# Altium schematic sheet 07.MIPI_DSI.SchDoc
size A4; CheckedBy: YPC; DocumentNumber: 7; Revision: V1.00; SheetNumber: 07; SheetTotal: 18; SheetName: MIPI_DSI; SheetDescribe: SheetDescribe; Designer: JOW; DesignDate: 2025-04-25; CheckedData: 2025-04-25
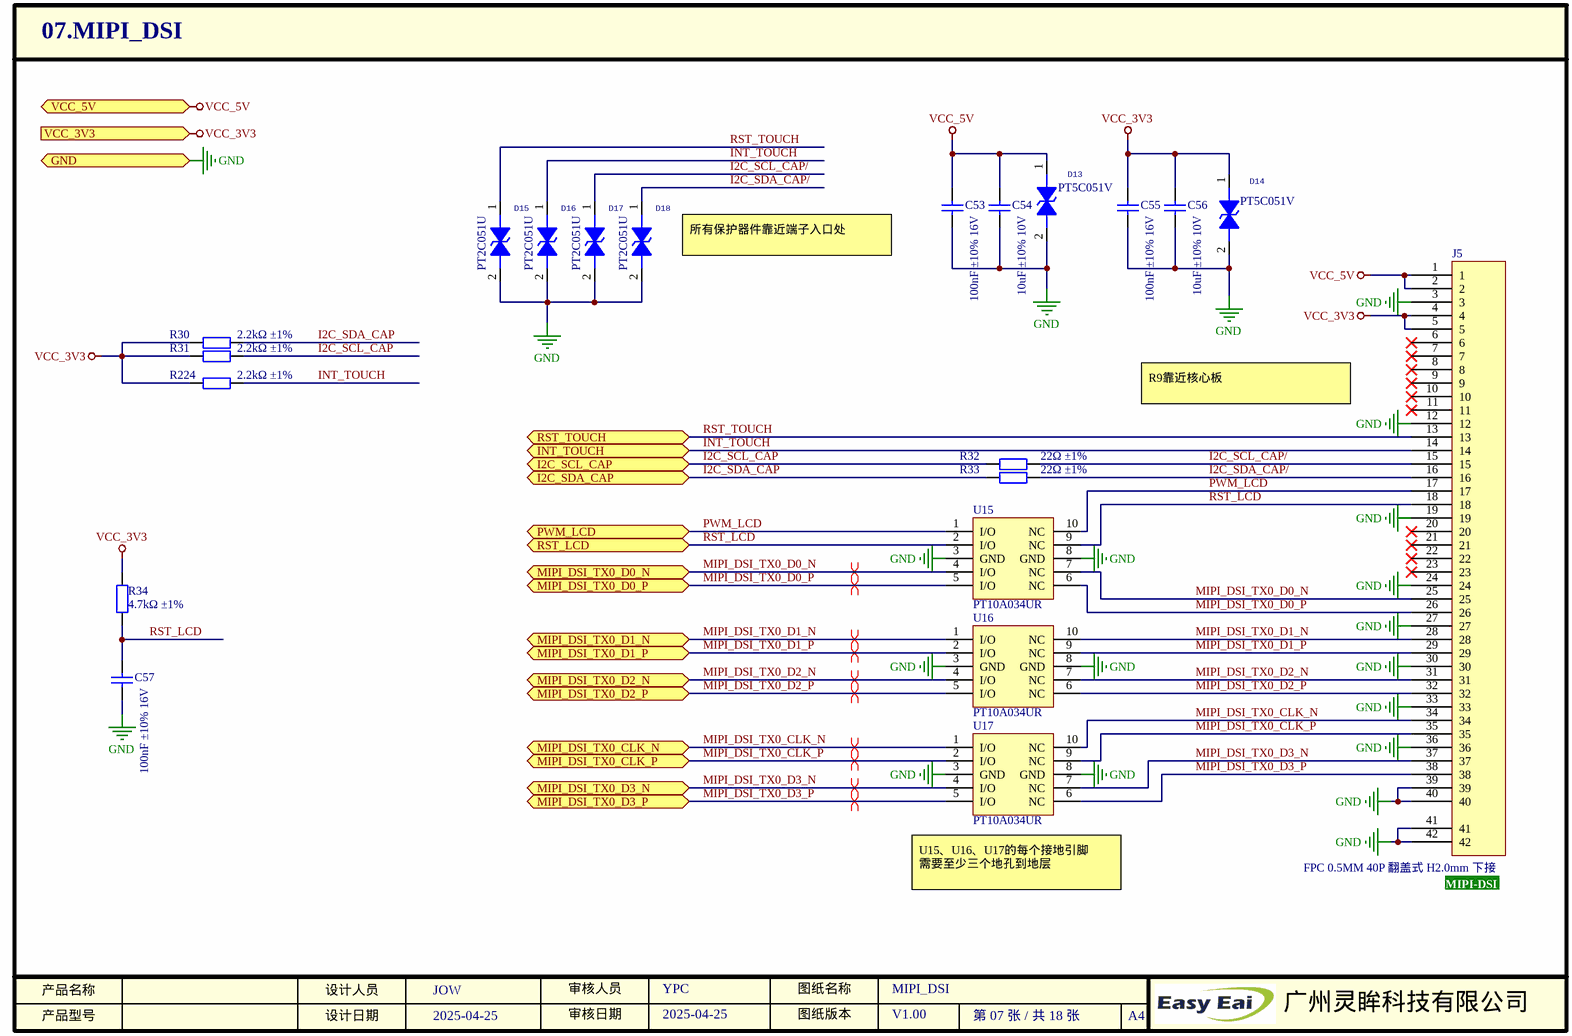
[diagram p0: 07.MIPI_DSI.SchDoc]

## Parts
C53  描述: 100nF ±10% 16V  [0402_C]  (hidden comment: CL05B104KO5NNNC)
C54  描述: 10uF ±10% 10V  [0603_C]  (hidden comment: CL10A106KP8NNNC)
C55  描述: 100nF ±10% 16V  [0402_C]  (hidden comment: CL05B104KO5NNNC)
C56  描述: 10uF ±10% 10V  [0603_C]  (hidden comment: CL10A106KP8NNNC)
C57  描述: 100nF ±10% 16V  [0402_C]  (hidden comment: CL05B104KO5NNNC)
D13  PT5C051V  [SOD-523]
D14  PT5C051V  [SOD-523]
D15  PT2C051U  [DFN1006]
D16  PT2C051U  [DFN1006]
D17  PT2C051U  [DFN1006]
D18  PT2C051U  [DFN1006]
J5  AFC01-S40FCA-00  [FFC0.5-40P]  (value not drawn)
R30  描述: 2.2kΩ ±1%  [0402_R]  (hidden comment: AC0402FR-072K2L)
R31  描述: 2.2kΩ ±1%  [0402_R]  (hidden comment: AC0402FR-072K2L)
R32  描述: 22Ω ±1%  [0402_R]  (hidden comment: 0402WGF220JTCE)
R33  描述: 22Ω ±1%  [0402_R]  (hidden comment: 0402WGF220JTCE)
R34  描述: 4.7kΩ ±1%  [0402_R]  (hidden comment: 0402WGF4701TCE)
R224  描述: 2.2kΩ ±1%  [0402_R]  (hidden comment: AC0402FR-072K2L)
U15  PT10A034UR  [DFN2510]
U16  PT10A034UR  [DFN2510]
U17  PT10A034UR  [DFN2510]

## Ports
GND, I2C_SCL_CAP, I2C_SDA_CAP, INT_TOUCH, MIPI_DSI_TX0_CLK_N, MIPI_DSI_TX0_CLK_P, MIPI_DSI_TX0_D0_N, MIPI_DSI_TX0_D0_P, MIPI_DSI_TX0_D1_N, MIPI_DSI_TX0_D1_P, MIPI_DSI_TX0_D2_N, MIPI_DSI_TX0_D2_P, MIPI_DSI_TX0_D3_N, MIPI_DSI_TX0_D3_P, PWM_LCD, RST_LCD, RST_TOUCH, VCC_3V3, VCC_5V

## Nets
GND: C53.1 C54.1 C55.1 C56.1 C57.1 D13.2 D14.2 D15.2 D16.2 D17.2 D18.2 J5.3 J5.12 J5.19 J5.24 J5.27 J5.30 J5.33 J5.36 J5.39 J5.40 J5.41 J5.42 U15.3(GND) U15.8(GND) U16.3(GND) U16.8(GND) U17.3(GND) U17.8(GND) ; port GND
VCC_3V3: C55.2 C56.2 D14.1 J5.4 J5.5 R30.1 R31.1 R34.2 R224.1 ; port VCC_3V3
VCC_5V: C53.2 C54.2 D13.1 J5.1 J5.2 ; port VCC_5V
I2C_SCL_CAP: R31.2 R32.1 ; port I2C_SCL_CAP
I2C_SCL_CAP/: D17.1 J5.15 R32.2
I2C_SDA_CAP: R30.2 R33.1 ; port I2C_SDA_CAP
I2C_SDA_CAP/: D18.1 J5.16 R33.2
INT_TOUCH: D16.1 J5.14 R224.2 ; port INT_TOUCH
MIPI_DSI_TX0_CLK_N: J5.34 U17.1(I/O) U17.10(NC) ; port MIPI_DSI_TX0_CLK_N
MIPI_DSI_TX0_CLK_P: J5.35 U17.2(I/O) U17.9(NC) ; port MIPI_DSI_TX0_CLK_P
MIPI_DSI_TX0_D0_N: J5.25 U15.4(I/O) U15.7(NC) ; port MIPI_DSI_TX0_D0_N
MIPI_DSI_TX0_D0_P: J5.26 U15.5(I/O) U15.6(NC) ; port MIPI_DSI_TX0_D0_P
MIPI_DSI_TX0_D1_N: J5.28 U16.1(I/O) U16.10(NC) ; port MIPI_DSI_TX0_D1_N
MIPI_DSI_TX0_D1_P: J5.29 U16.2(I/O) U16.9(NC) ; port MIPI_DSI_TX0_D1_P
MIPI_DSI_TX0_D2_N: J5.31 U16.4(I/O) U16.7(NC) ; port MIPI_DSI_TX0_D2_N
MIPI_DSI_TX0_D2_P: J5.32 U16.5(I/O) U16.6(NC) ; port MIPI_DSI_TX0_D2_P
MIPI_DSI_TX0_D3_N: J5.37 U17.4(I/O) U17.7(NC) ; port MIPI_DSI_TX0_D3_N
MIPI_DSI_TX0_D3_P: J5.38 U17.5(I/O) U17.6(NC) ; port MIPI_DSI_TX0_D3_P
PWM_LCD: J5.17 U15.1(I/O) U15.10(NC) ; port PWM_LCD
RST_LCD: C57.2 J5.18 R34.1 U15.2(I/O) U15.9(NC) ; port RST_LCD
RST_TOUCH: D15.1 J5.13 ; port RST_TOUCH

Not connected (* = marked no-connect by the designer): J5 6* 7* 8* 9* 10* 11* 20* 21* 22* 23*

## Layout directives
differential pair: MIPI_DSI_TX0_CLK_N, MIPI_DSI_TX0_CLK_P, MIPI_DSI_TX0_D0_N, MIPI_DSI_TX0_D0_P, MIPI_DSI_TX0_D1_N, MIPI_DSI_TX0_D1_P, MIPI_DSI_TX0_D2_N, MIPI_DSI_TX0_D2_P, MIPI_DSI_TX0_D3_N, MIPI_DSI_TX0_D3_P

## Notes on the sheet
- 所有保护器件靠近端子入口处
- R9靠近核心板
- (near U17) U15、U16、U17的每个接地引脚
  需要至少三个地孔到地层
- (near J5) MIPI-DSI
- 产品名称
- 产品型号
- 设计人员
- 设计日期
- 审核人员
- 审核日期
- 图纸版本
- 图纸名称
- A4
- 广州灵眸科技有限公司

## Library data of the parts
C53 C55 C57 = 0402 100nF ±10% 16V: SPZL000259; 名称: 贴片电容; 厂商: SAMSUNG(三星); 封装: 0402; 工作温度: -55~125℃; 贴片和直插: SMD; 型号: CL05B104KO5NNNC; SuppliersPartNumber: C1525; 商品编号: SPZL000259
C54 C56 = 0603 10uF ±10% 10V: SPZL000260; 名称: 贴片电容; 厂商: SAMSUNG(三星); 封装: 0603; 工作温度: -55~85℃; 贴片和直插: SMD; 型号: CL10A106KP8NNNC; SuppliersPartNumber: C19702; 商品编号: SPZL000260
D13 D14 = PT5C051V: SPZL001155; 名称: ESD; 贴片和直插: SMD; 厂商: 玛珂斯科技; 描述: Vrwm=5V,Vc=25V,Ipp=5A; 工作温度: -55~125℃; 封装: SOD-523; 商品编号: SPZL001155; 型号: PT5C051V
D15-D18 = PT2C051U: SPZL001147; 名称: ESD; 贴片和直插: SMD; 厂商: 玛珂斯科技; 描述: Vrwm=5V, Cj=0.3pF; 工作温度: -55~125℃; 封装: DFN1006; 商品编号: SPZL001147; 型号: PT2C051U
J5 = FPC 0.5MM 40P 翻盖式 H2.0mm 下接: SPZL000107; 名称: FPC座子; 厂商: JS(钜硕电子); 贴片和直插: SMD; 封装: SMD,P=0.5mm; 工作温度: -25~85℃; SuppliersPartNumber: C262674; 型号: AFC01-S40FCA-00; 商品编号: SPZL000107; 描述: FPC 0.5MM 40P 翻盖式 H2.0mm 下接
R30 R31 R224 = 0402 2.2kΩ ±1%: SPZL000307; 封装: 0402; 厂商: YAGEO(国巨); 贴片和直插: SMD; 名称: 电阻; 工作温度: -55~155℃; SuppliersPartNumber: C144773; 型号: AC0402FR-072K2L; 商品编号: SPZL000307
R32 R33 = 0402 22Ω ±1%: SPZL000279; 封装: 0402; 厂商: UNI-ROYAL(厚声); 贴片和直插: SMD; 名称: 电阻; 工作温度: -55~155℃; SuppliersPartNumber: C25092; 型号: 0402WGF220JTCE; 商品编号: SPZL000279
R34 = 0402 4.7kΩ ±1%: SPZL000280; 封装: 0402; 厂商: UNI-ROYAL(厚声); 贴片和直插: SMD; 名称: 电阻; 工作温度: -55~155℃; SuppliersPartNumber: C25900; 型号: 0402WGF4701TCE; 商品编号: SPZL000280
U15-U17 = PT10A034UR: SPZL001146; 名称: ESD; 厂商: 玛珂斯科技; 贴片和直插: SMD; 描述: Vrwm=3.3V Cj=0.3pF; 工作温度: -55~125℃; 封装: DFN2510; 商品编号: SPZL001146; 型号: PT10A034UR